# EAGLE schematic numitron_clock (EAGLE 7.5.0)
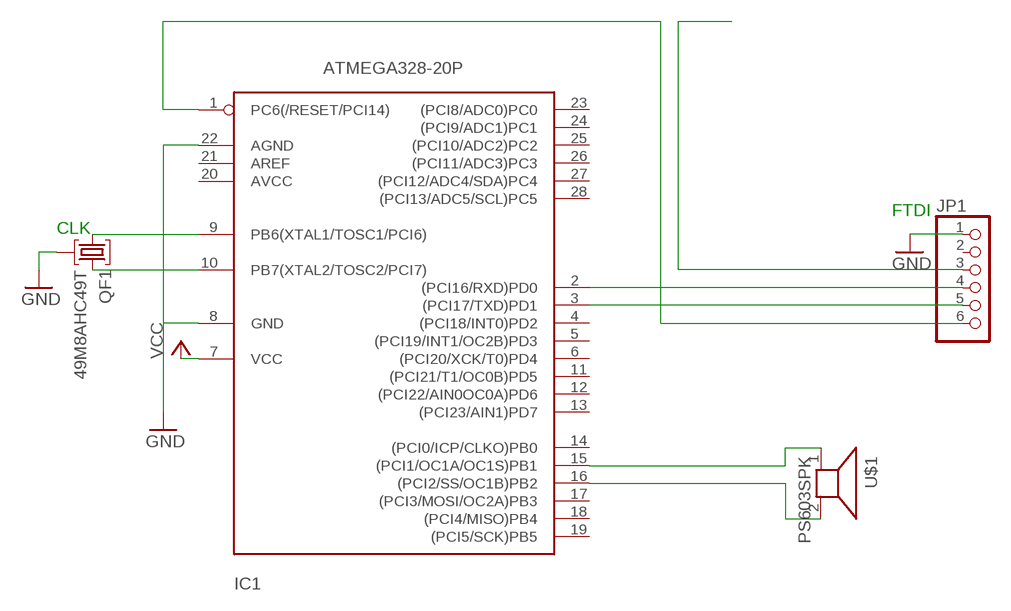
[diagram p0: schematic, sheet 1]

## Parts
IC1  ATMEGA328-20P  [DIL28-3]
JP1  PINHD-1X6  [1X06]
QF1  49M8AHC49T  [HC49U]
U$1  PS603SPK  [PS603]

## Nets
GND: IC1.8(GND) IC1.22(AGND) JP1.1 QF1.2
N$1: IC1.2((PCI16/RXD)PD0) JP1.4
N$2: IC1.3((PCI17/TXD)PD1) JP1.5
N$3: IC1.15((PCI1/OC1A/OC1S)PB1) U$1.1
N$4: IC1.9(PB6(XTAL1/TOSC1/PCI6)) QF1.1
N$5: IC1.10(PB7(XTAL2/TOSC2/PCI7)) QF1.3
N$6: JP1.3
N$7: IC1.1(PC6(/RESET/PCI14)) JP1.6
N$8: IC1.16((PCI2/SS/OC1B)PB2) U$1.2
VCC: IC1.7(VCC)
Unconnected: IC1.4((PCI18/INT0)PD2) IC1.5((PCI19/INT1/OC2B)PD3) IC1.6((PCI20/XCK/T0)PD4) IC1.11((PCI21/T1/OC0B)PD5) IC1.12((PCI22/AIN0OC0A)PD6) IC1.13((PCI23/AIN1)PD7) IC1.14((PCI0/ICP/CLKO)PB0) IC1.17((PCI3/MOSI/OC2A)PB3) IC1.18((PCI4/MISO)PB4) IC1.19((PCI5/SCK)PB5) IC1.20(AVCC) IC1.21(AREF) IC1.23((PCI8/ADC0)PC0) IC1.24((PCI9/ADC1)PC1) IC1.25((PCI10/ADC2)PC2) IC1.26((PCI11/ADC3)PC3) IC1.27((PCI12/ADC4/SDA)PC4) IC1.28((PCI13/ADC5/SCL)PC5) JP1.2

## Notes on the sheet
- FTDI
- CLK

## Library data of the parts
IC1 = atmega328:ATMEGA328*P: MICROCONTROLLER 32 kBytes FLASH 2 kBytes SRAM 1 kBytes EEPROM USART 8-channel 10 bit ADC
JP1 = adafruit:PINHD-1X6: PIN HEADER
QF1 = crystal:49M8AHC49T: Monolithic Crystal Filters Source: www.vanlong.com; OC_FARNELL: unknown; OC_NEWARK: unknown
U$1 = adafruit:PS603: PS603 Small 8 ohm speaker, from Mouser. Can SMT solder to board http://www.ladyada.net/library/pcb/eaglelibrary.html